# Altium schematic sheet Module.SchDoc
size A4; SheetNumber: 1; SheetTotal: 4
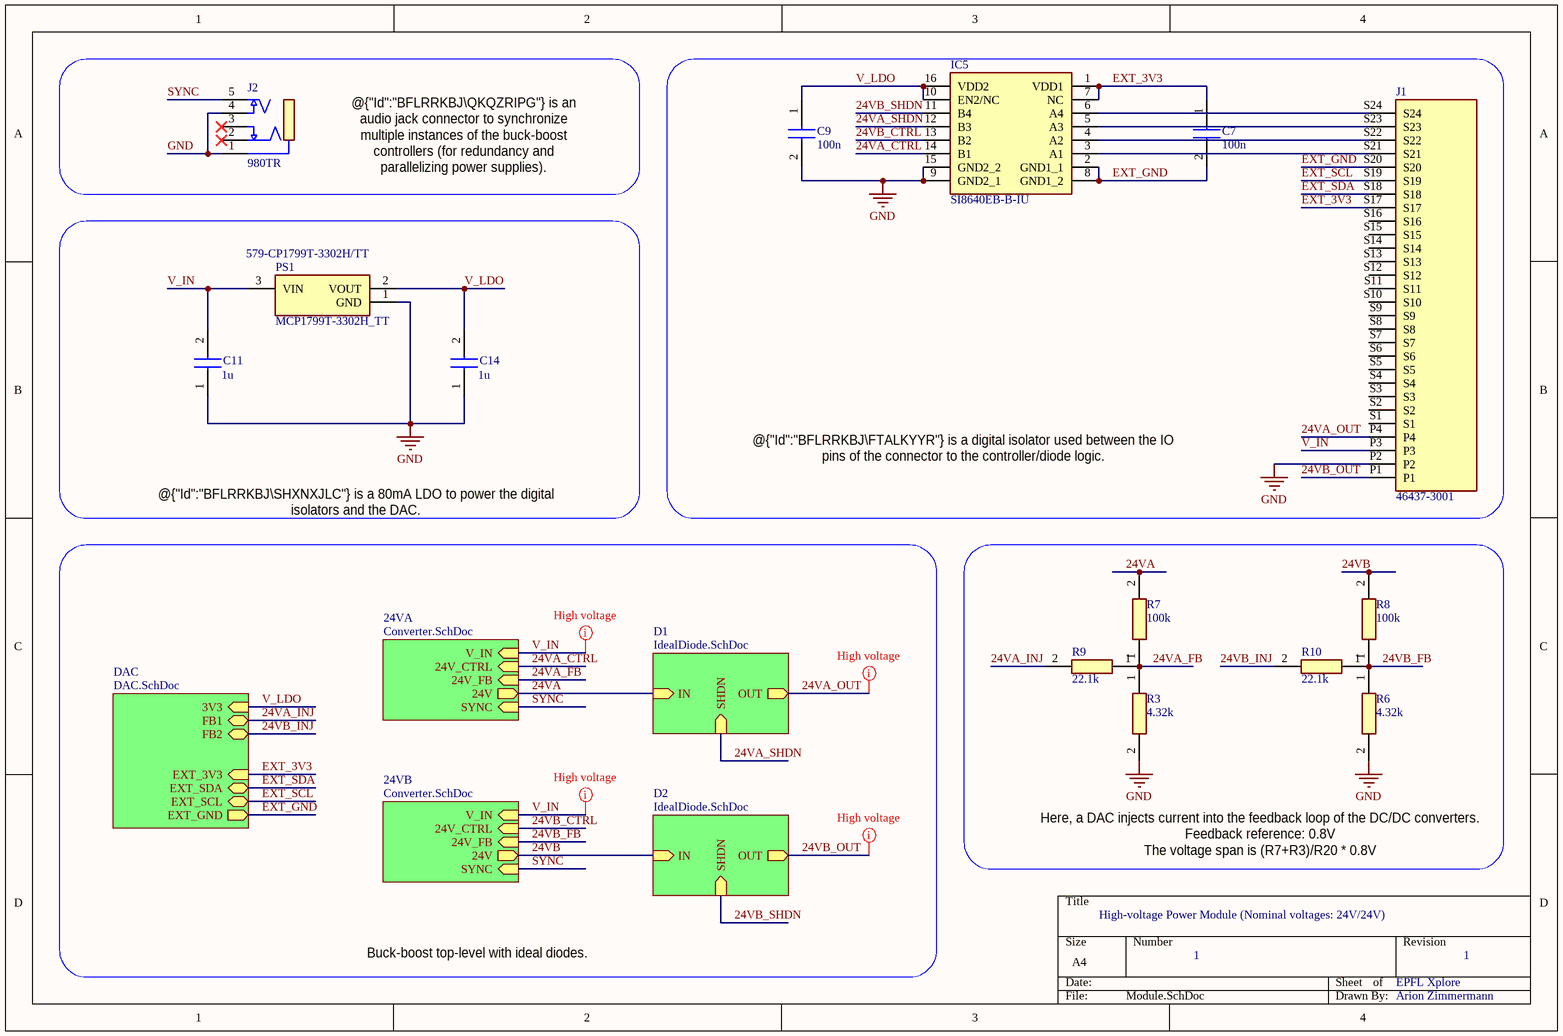
[diagram p0: Module.SchDoc]

## Parts
C7  value 100n  [CAPC1608X95N]  (hidden comment: C0603C104K5RACTU)
C9  value 100n  [CAPC1608X95N]  (hidden comment: C0603C104K5RACTU)
C11  value 1u  [CAPC3216X110N]  (hidden comment: C1206C105K5RAC)
C14  value 1u  [CAPC3216X110N]  (hidden comment: C1206C105K5RAC)
IC5  SI8640EB-B-IU  [SOP64P600X175-16N]
J1  46437-3001  [464373001]
J2  980TR  [980TR]
PS1  MCP1799T-3302H_TT  Supplier Part Number 1: 579-CP1799T-3302H/TT  [SOT95P237X112-3N]
R3  value 4.32k  [RESC1608X50N]  (hidden comment: CRCW06034K32FKEA)
R6  value 4.32k  [RESC1608X50N]  (hidden comment: CRCW06034K32FKEA)
R7  value 100k  [RESC1608X55N]  (hidden comment: CRCW0603100KJNEAC)
R8  value 100k  [RESC1608X55N]  (hidden comment: CRCW0603100KJNEAC)
R9  value 22.1k  [RESC1608X50N]  (hidden comment: CRCW060322K1FKEB)
R10  value 22.1k  [RESC1608X50N]  (hidden comment: CRCW060322K1FKEB)

## Sub-sheets
24VA = Converter.SchDoc: V_IN (in), 24V_CTRL (in), 24V_FB (in), 24V (out), SYNC (in)
24VB = Converter.SchDoc: V_IN (in), 24V_CTRL (in), 24V_FB (in), 24V (out), SYNC (in)
D1 = IdealDiode.SchDoc: IN (in), OUT (out), SHDN (in)
D2 = IdealDiode.SchDoc: IN (in), OUT (out), SHDN (in)
DAC = DAC.SchDoc: 3V3 (in), FB2 (bidir), FB1 (bidir), EXT_3V3 (in), EXT_SDA (bidir), EXT_SCL (bidir), EXT_GND (out)

## Nets
GND: C9.2 C11.1 C14.1 IC5.9(GND2_1) IC5.15(GND2_2) J1.P2 J2.1 J2.4 PS1.1(GND) R3.2 R6.2
24VA: R7.2 ; sheet D1/IN, sheet 24VA/24V
24VA_CTRL: IC5.14(B1) ; sheet 24VA/24V_CTRL
24VA_FB: R3.1 R7.1 R9.1 ; sheet 24VA/24V_FB
24VA_INJ: R9.2 ; sheet DAC/FB1
24VA_OUT: J1.P4 ; sheet D1/OUT
24VA_SHDN: IC5.12(B3) ; sheet D1/SHDN
24VB: R8.2 ; sheet D2/IN, sheet 24VB/24V
24VB_CTRL: IC5.13(B2) ; sheet 24VB/24V_CTRL
24VB_FB: R6.1 R8.1 R10.1 ; sheet 24VB/24V_FB
24VB_INJ: R10.2 ; sheet DAC/FB2
24VB_OUT: J1.P1 ; sheet D2/OUT
24VB_SHDN: IC5.11(B4) ; sheet D2/SHDN
EXT_3V3: C7.1 IC5.1(VDD1) IC5.7(NC) J1.S17 ; sheet DAC/EXT_3V3
EXT_GND: C7.2 IC5.2(GND1_1) IC5.8(GND1_2) J1.S20 ; sheet DAC/EXT_GND
EXT_SCL: J1.S19 ; sheet DAC/EXT_SCL
EXT_SDA: J1.S18 ; sheet DAC/EXT_SDA
SYNC: J2.5 ; sheet 24VA/SYNC, sheet 24VB/SYNC
V_IN: C11.2 J1.P3 PS1.3(VIN) ; sheet 24VA/V_IN, sheet 24VB/V_IN
V_LDO: C9.1 C14.2 IC5.10(EN2/NC) IC5.16(VDD2) PS1.2(VOUT) ; sheet DAC/3V3
NetIC5_3: IC5.3(A1) J1.S21
NetIC5_4: IC5.4(A2) J1.S22
NetIC5_5: IC5.5(A3) J1.S23
NetIC5_6: IC5.6(A4) J1.S24

Not connected (* = marked no-connect by the designer): J1 S1 S2 S3 S4 S5 S6 S7 S8 S9 S10 S11 S12 S13 S14 S15 S16; J2 2* 3*

## Layout directives
net class HV: 24VA_OUT, 24VB_OUT, V_IN

## Notes on the sheet
- @{"Id":"BFLRRKBJ\QKQZRIPG"} is an audio jack connector to synchronize multiple instances of the buck-boost controllers (for redundancy and parallelizing power supplies).
- @{"Id":"BFLRRKBJ\SHXNXJLC"} is a 80mA LDO to power the digital isolators and the DAC.
- @{"Id":"BFLRRKBJ\FTALKYYR"} is a digital isolator used between the IO pins of the connector to the controller/diode logic.
- Here, a DAC injects current into the feedback loop of the DC/DC converters.
  Feedback reference: 0.8V
  The voltage span is (R7+R3)/R20 * 0.8V
- High-voltage Power Module (Nominal voltages: 24V/24V)
- Buck-boost top-level with ideal diodes.
- 1
- EPFL Xplore
- Arion Zimmermann

## Library data of the parts
C7 C9 = C0603C104K5RACTU: Capacitor; Manufacturer_Name: Kemet; Datasheet Link: http://www.farnell.com/datasheets/2205446.pdf; Height: 0.95mm; Manufacturer_Part_Number: C0603C104K5RACTU; Mouser Part Number: 80-C0603C104K5R; Mouser Price/Stock: https://www.mouser.co.uk/ProductDetail/KEMET/C0603C104K5RACTU?qs=l5k%252BbMnNDkkVcnZPSAaaiQ%3D%3D; Arrow Part Number: C0603C104K5RACTU; Arrow Price/Stock: https://www.arrow.com/en/products/c0603c104k5ractu/kemet-corporation; Supplier 1: Mouser; Supplier Part Number 1: 80-C0603C104K5R
C11 C14 = C1206C105K5RAC: Capacitor; Manufacturer_Name: KEMET; Datasheet Link: https://www.kemet.com/specsheet/C1206C105K5RACTU; Height: 1.1mm; Manufacturer_Part_Number: C1206C105K5RAC; Mouser Part Number: 80-C1206C105K5RAC; Mouser Price/Stock: https://www.mouser.co.uk/ProductDetail/KEMET/C1206C105K5RAC?qs=NTAB53G5bVDYFBtoIe7UwQ%3D%3D; Arrow Part Number: C1206C105K5RAC; Arrow Price/Stock: https://www.arrow.com/en/products/c1206c105k5rac/kemet-corporation
IC5 = SI8640EB-B-IU: Integrated Circuit; Manufacturer_Name: Skyworks; Datasheet Link: https://www.mouser.in/datasheet/2/472/si864x_datasheet-2507790.pdf; Height: 1.75mm; Manufacturer_Part_Number: SI8640EB-B-IU; Mouser Part Number: 634-SI8640EB-B-IU; Mouser Price/Stock: https://www.mouser.co.uk/ProductDetail/Skyworks-Solutions-Inc/SI8640EB-B-IU?qs=1mbolxNpo8djAX8%252BwHCeQQ%3D%3D
J1 = 46437-3001: Connector; Manufacturer_Name: Molex; Datasheet Link: https://componentsearchengine.com/Datasheets/1/46437-3007.pdf; Height: 10mm; Manufacturer_Part_Number: 46437-3001; Mouser Part Number: 538-46437-3001; Mouser Price/Stock: https://www.mouser.com/Search/Refine.aspx?Keyword=538-46437-3007; System: Connector
J2 = 980TR: Connector; Manufacturer_Name: Keystone Electronics; Datasheet Link: https://www.keyelco.com/product.cfm/product_id/2402; Height: 4.14mm; Manufacturer_Part_Number: 980TR; Mouser Part Number: 534-980; Mouser Price/Stock: https://www.mouser.co.uk/ProductDetail/Keystone-Electronics/980TR?qs=sOYabIlKNmdpbsH5J2zkLQ%3D%3D
PS1 = MCP1799T-3302H_TT: Power Supply; Manufacturer_Name: Microchip; Manufacturer_Part_Number: MCP1799T-3302H/TT; Datasheet Link: https://ms.componentsearchengine.com/Datasheets/1/MCP1799T-3302H_TT.pdf; Height: 1.12mm; Mouser Part Number: 579-CP1799T-3302H/TT; Mouser Price/Stock: https://www.mouser.co.uk/ProductDetail/Microchip-Technology-Atmel/MCP1799T-3302H-TT?qs=BJlw7L4Cy78EAGTR6Iuibw%3D%3D; Arrow Part Number: MCP1799T-3302H/TT; Arrow Price/Stock: https://www.arrow.com/en/products/mcp1799t-3302htt/microchip-technology?region=nac; Supplier 1: Mouser
R3 R6 = CRCW06034K32FKEA: Resistor; Manufacturer_Name: Vishay; Datasheet Link: http://www.vishay.com/docs/20035/dcrcwe3.pdf; Height: 0.5mm; Manufacturer_Part_Number: CRCW06034K32FKEA; Mouser Part Number: 71-CRCW0603-4.32K-E3; Mouser Price/Stock: https://www.mouser.com/Search/Refine.aspx?Keyword=71-CRCW0603-4.32K-E3; Arrow Part Number: CRCW06034K32FKEA; Arrow Price/Stock: https://www.arrow.com/en/products/crcw06034k32fkea/vishay; Supplier 1: Mouser; Supplier Part Number 1: 71-CRCW0603-4.32K-E3
R7 R8 = CRCW0603100KFKEAC: Resistor; Manufacturer_Name: Vishay; Datasheet Link: https://www.mouser.com/datasheet/2/427/crcwce3-1223726.pdf; Height: 0.55mm; Manufacturer_Part_Number: CRCW0603100KFKEAC; Mouser Part Number: 71-CRCW0603100KFKEAC; Mouser Price/Stock: https://www.mouser.co.uk/ProductDetail/Vishay-Dale/CRCW0603100KFKEAC?qs=E3Y5ESvWgWPxzfNYyMgX1w%3D%3D; Arrow Part Number: CRCW0603100KFKEAC; Arrow Price/Stock: https://www.arrow.com/en/products/crcw0603100kfkeac/vishay; Supplier 1: Mouser; Supplier Part Number 1: 71-CRCW0603100KJNEAC
R9 R10 = CRCW06037K50FKEB: Resistor; Manufacturer_Name: Vishay; Datasheet Link: http://www.vishay.com/docs/20035/dcrcwe3.pdf; Height: 0.5mm; Manufacturer_Part_Number: CRCW06037K50FKEB; Mouser Part Number: 71-CRCW06037K50FKEB; Mouser Price/Stock: https://www.mouser.co.uk/ProductDetail/Vishay-Dale/CRCW06037K50FKEB?qs=2ihuRUavkaTvW2vO4EimMQ%3D%3D; Supplier 1: Mouser; Supplier Part Number 1: 71-CRCW060322K1FKEB